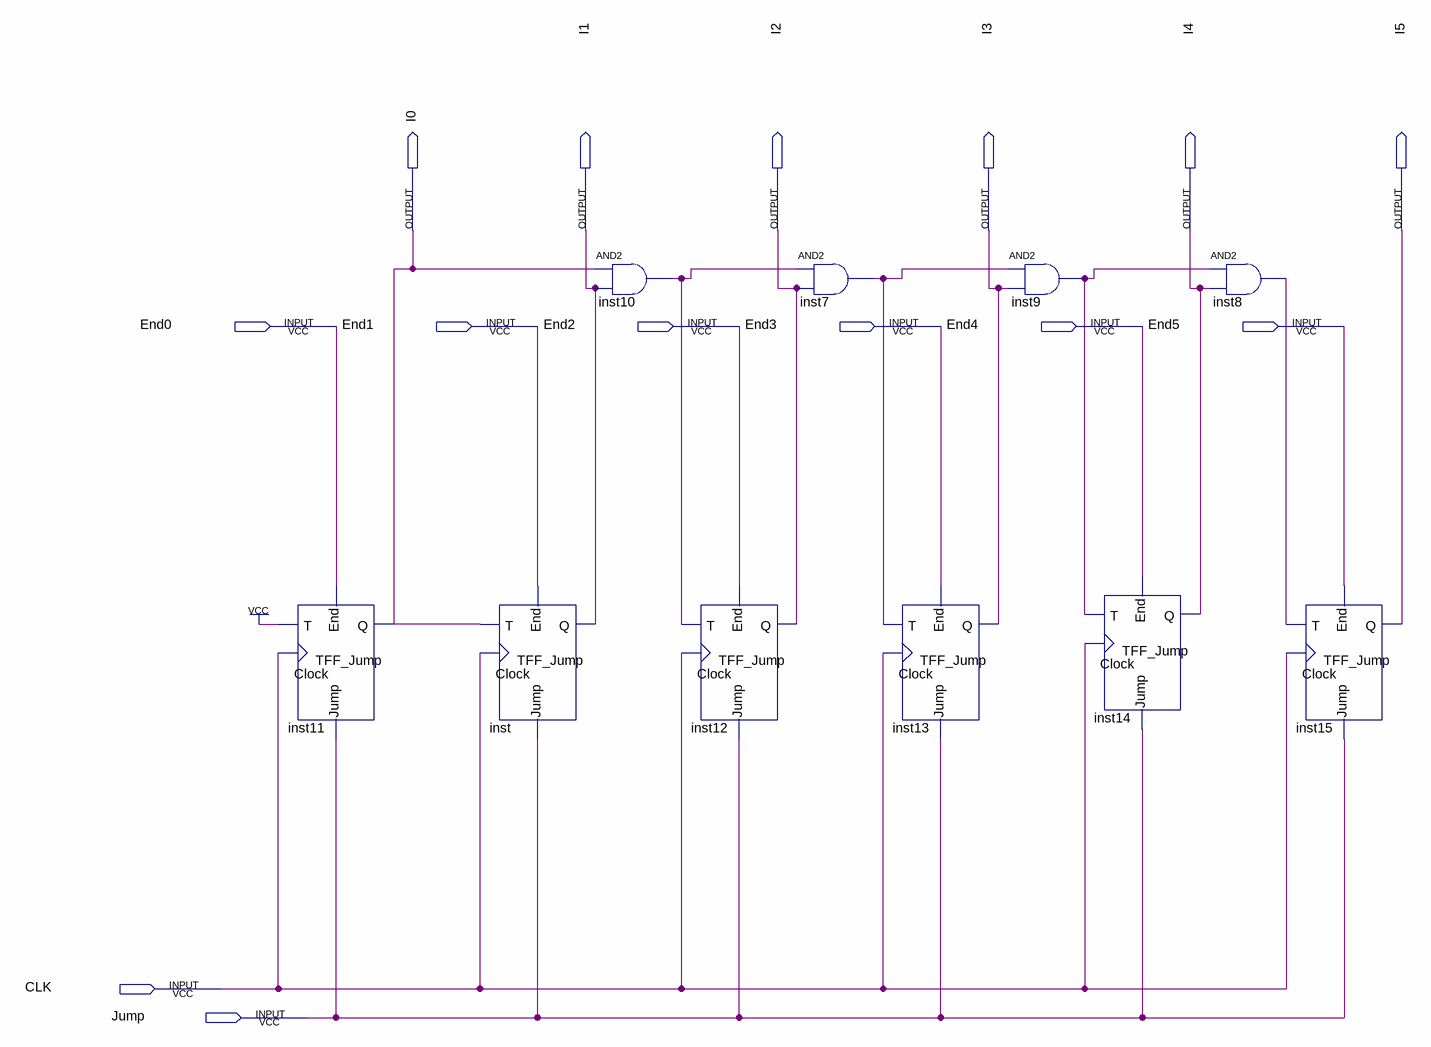
[diagram p0: schematic sheet]
// Quartus schematic Synchronous_Counter_with_Jump.bdf as structural Verilog: 10 symbols, 14 pins
module Synchronous_Counter_with_Jump (
  input  End0,
  input  End1,
  input  End2,
  input  End3,
  input  End4,
  input  End5,
  input  CLK,
  input  Jump,
  output I0,
  output I1,
  output I2,
  output I3,
  output I4,
  output I5
);

  wire inst7_out, inst8_out, inst9_out, inst10_out;

  TFF_Jump inst11 (.End(End0), .Jump(Jump), .T(1'b1), .Clock(CLK), .Q(I0));
  TFF_Jump inst (.End(End1), .Jump(Jump), .T(I0), .Clock(CLK), .Q(I1));
  and inst10 (inst10_out, I0, I1);
  TFF_Jump inst12 (.End(End2), .Jump(Jump), .T(inst10_out), .Clock(CLK), .Q(I2));
  and inst7 (inst7_out, inst10_out, I2);
  TFF_Jump inst13 (.End(End3), .Jump(Jump), .T(inst7_out), .Clock(CLK), .Q(I3));
  and inst9 (inst9_out, inst7_out, I3);
  TFF_Jump inst14 (.End(End4), .Jump(Jump), .T(inst9_out), .Clock(CLK), .Q(I4));
  and inst8 (inst8_out, inst9_out, I4);
  TFF_Jump inst15 (.End(End5), .Jump(Jump), .T(inst8_out), .Clock(CLK), .Q(I5));
endmodule
